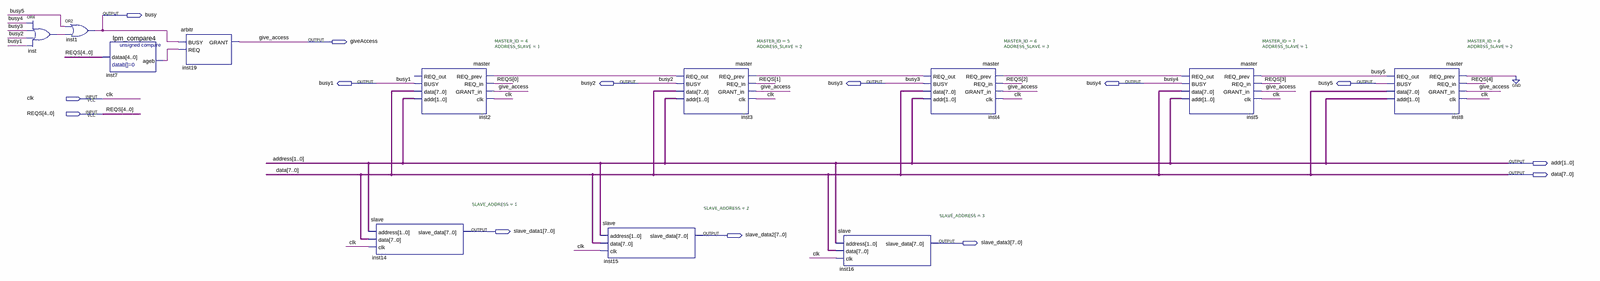
[diagram p0: schematic sheet, whole]
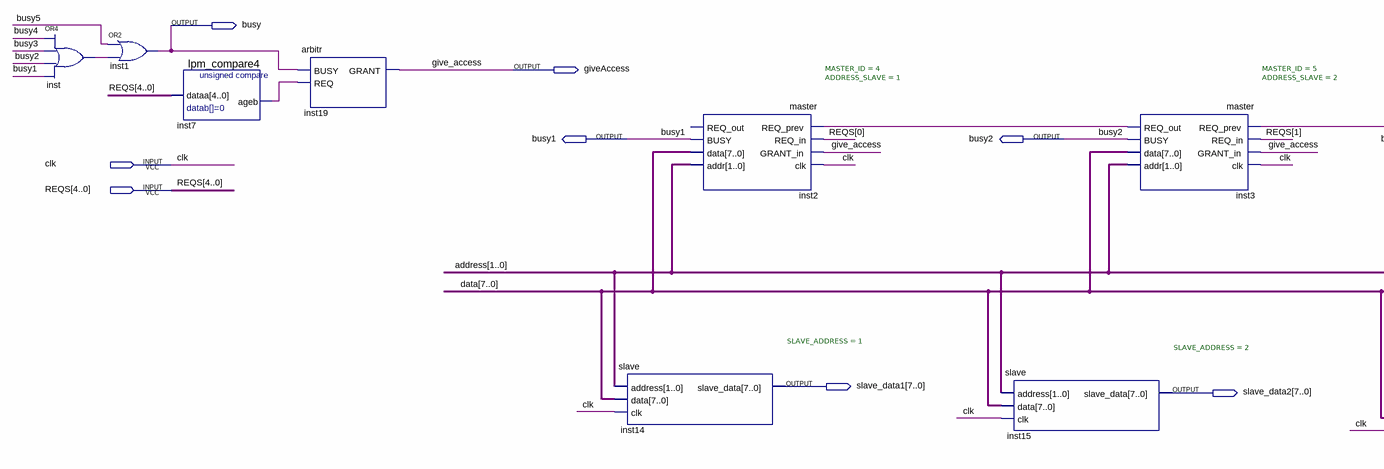
[diagram p1: schematic sheet, left part]
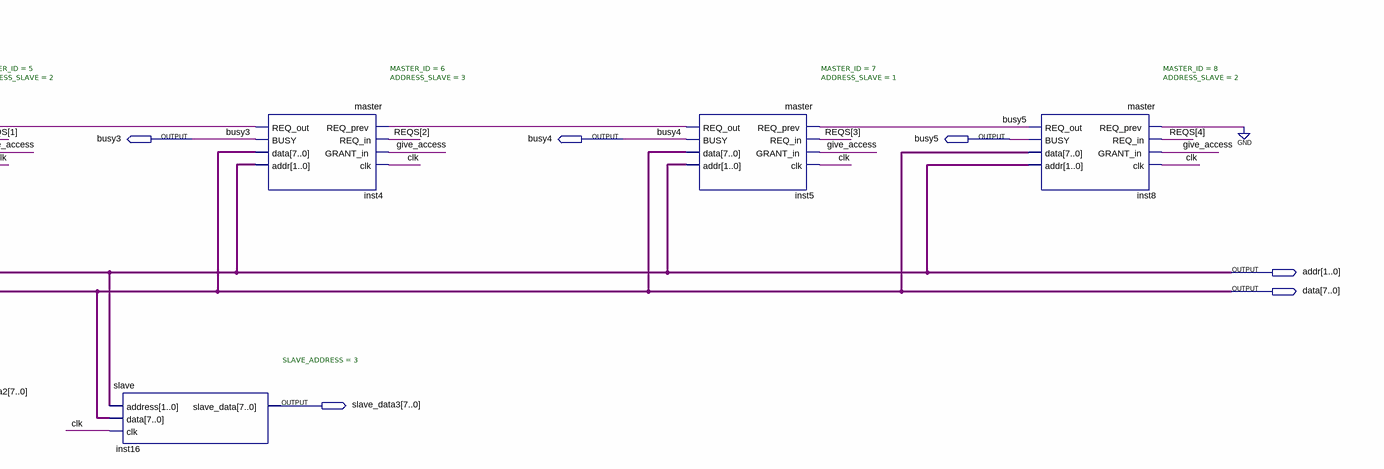
[diagram p2: schematic sheet, right part]
// Quartus schematic lab5.bdf as structural Verilog: 12 symbols, 14 pins
module lab5 (
  input  clk,
  input  [4:0] REQS,
  output busy,
  output giveAccess,
  output busy1,
  output busy2,
  output busy3,
  output busy4,
  output busy5,
  output [1:0] addr,
  output [7:0] data,
  output [7:0] slave_data1,
  output [7:0] slave_data2,
  output [7:0] slave_data3
);

  wire inst3_req_out, inst4_req_out, inst5_req_out, inst7_ageb, inst8_req_out, inst_out;

  or inst (inst_out, busy4, busy3, busy2, busy1);
  or inst1 (busy, busy5, inst_out);
  lpm_compare4 inst7 (.dataa(REQS), .ageb(inst7_ageb));
  arbitr inst19 (.BUSY(busy), .REQ(inst7_ageb), .GRANT(giveAccess));
  slave #(.SLAVE_ADDRESS(1)) inst14 (.address(addr), .data(data), .clk(clk), .slave_data(slave_data1));
  master #(.MASTER_ID(4), .ADDRESS_SLAVE(1)) inst2 (
    .REQ_prev(inst3_req_out), .REQ_in(REQS[0]), .GRANT_in(giveAccess), .clk(clk), .BUSY(busy1), .data(data),
    .addr(addr));  // open: REQ_out
  slave #(.SLAVE_ADDRESS(2)) inst15 (.address(addr), .data(data), .clk(clk), .slave_data(slave_data2));
  master #(.MASTER_ID(5), .ADDRESS_SLAVE(2)) inst3 (
    .REQ_prev(inst4_req_out), .REQ_in(REQS[1]), .GRANT_in(giveAccess), .clk(clk), .REQ_out(inst3_req_out),
    .BUSY(busy2), .data(data), .addr(addr));
  slave #(.SLAVE_ADDRESS(3)) inst16 (.address(addr), .data(data), .clk(clk), .slave_data(slave_data3));
  master #(.MASTER_ID(6), .ADDRESS_SLAVE(3)) inst4 (
    .REQ_prev(inst5_req_out), .REQ_in(REQS[2]), .GRANT_in(giveAccess), .clk(clk), .REQ_out(inst4_req_out),
    .BUSY(busy3), .data(data), .addr(addr));
  master #(.MASTER_ID(7), .ADDRESS_SLAVE(1)) inst5 (
    .REQ_prev(inst8_req_out), .REQ_in(REQS[3]), .GRANT_in(giveAccess), .clk(clk), .REQ_out(inst5_req_out),
    .BUSY(busy4), .data(data), .addr(addr));
  master #(.MASTER_ID(8), .ADDRESS_SLAVE(2)) inst8 (
    .REQ_prev(1'b0), .REQ_in(REQS[4]), .GRANT_in(giveAccess), .clk(clk), .REQ_out(inst8_req_out),
    .BUSY(busy5), .data(data), .addr(addr));

  // Other names for the same wires on the sheet: address[1:0] = addr; give_access = giveAccess
endmodule
